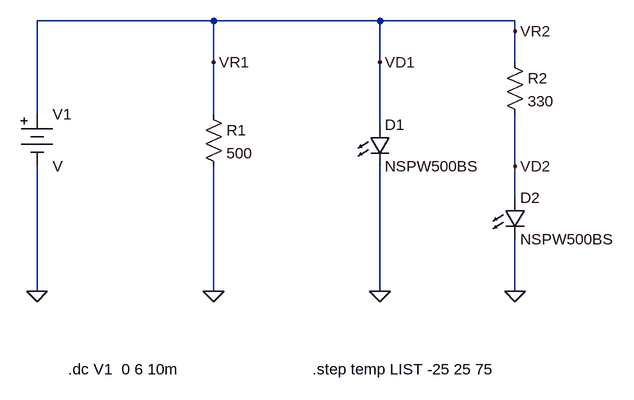
[diagram p0: schematic led.asc]
led.asc, the LTspice schematic file:
Version 4
SHEET 1 880 696
WIRE 256 144 -16 144
WIRE 512 144 256 144
WIRE 720 144 512 144
WIRE 720 160 720 144
WIRE 256 208 256 144
WIRE 512 208 512 144
WIRE 720 208 720 160
WIRE -16 288 -16 144
WIRE 256 288 256 208
WIRE 512 304 512 208
WIRE 720 368 720 288
WIRE 720 416 720 368
WIRE -16 560 -16 368
WIRE 256 560 256 368
WIRE 512 560 512 368
WIRE 720 560 720 480
FLAG -16 560 0
FLAG 256 560 0
FLAG 512 560 0
FLAG 720 560 0
FLAG 256 208 VR1
FLAG 512 208 VD1
FLAG 720 160 VR2
FLAG 720 368 VD2
SYMBOL res 240 272 R0
SYMATTR InstName R1
SYMATTR Value 500
SYMBOL res 704 192 R0
SYMATTR InstName R2
SYMATTR Value 330
SYMBOL LED 496 304 R0
SYMATTR InstName D1
SYMATTR Value NSPW500BS
SYMATTR Description Diode
SYMATTR Type diode
SYMBOL LED 704 416 R0
SYMATTR InstName D2
SYMATTR Value NSPW500BS
SYMATTR Description Diode
SYMATTR Type diode
SYMBOL Misc/battery -16 272 R0
SYMATTR InstName V1
TEXT 32 680 Left 2 !.dc V1  0 6 10m
TEXT 408 680 Left 2 !.step temp LIST -25 25 75

The netlist it stands for:
* led.asc
R1 VR2 0 500
R2 VR2 VD2 330
D1 VR2 0 NSPW500BS
D2 VD2 0 NSPW500BS
V1 VR2 0 V
.model D D
.lib standard.dio
.dc V1  0 6 10m
.step temp LIST -25 25 75
.backanno
.end